# EAGLE schematic SaintCon2015Badge (EAGLE 7.3.0)

## Sheet 1 of 3
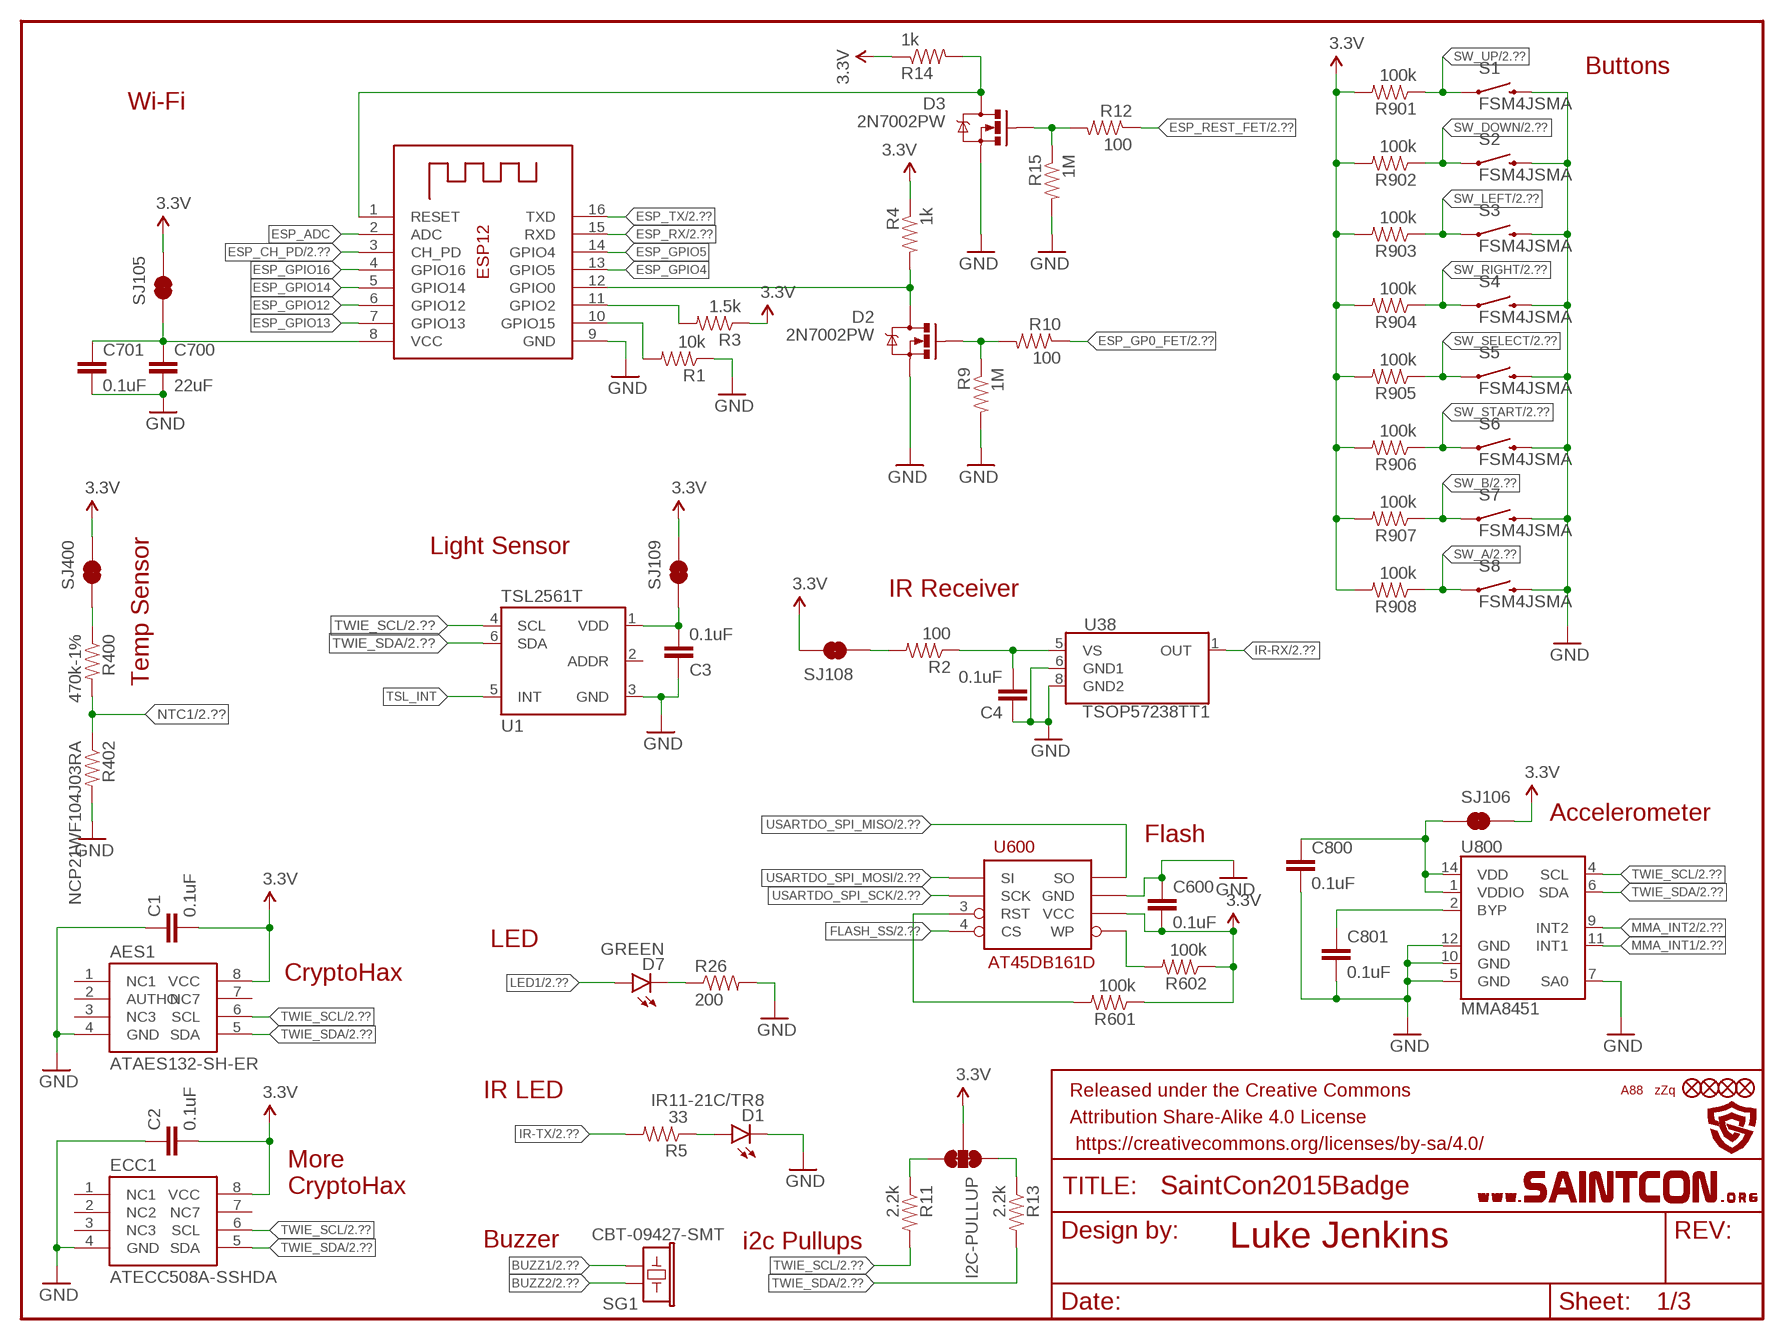
[diagram p0: schematic, sheet 1]

### Parts
AES1  ATAES132-SH-ER  ATAES132  [SOIC8]
C1  0.1uF  CAP0805  [0805]
C2  0.1uF  CAP0805  [0805]
C3  0.1uF  CAP0805  [0805]
C4  0.1uF  CAP0805  [0805]
C600  0.1uF  CAP0805  [0805]
C700  22uF  22UF-6.3V-20%(0805)  [0805]
C701  0.1uF  CAP0805  [0805]
C800  0.1uF  CAP0805  [0805]
C801  0.1uF  CAP0805  [0805]
D1  IR11-21C/TR8  LED1206  [LED-1206]
D2  2N7002PW  MOSFET-NCHANNEL2N7002PW  [SOT323]
D3  2N7002PW  MOSFET-NCHANNEL2N7002PW  [SOT323]
D7  GREEN  LED-RED1206  [LED-1206]
ECC1  ATECC508A-SSHDA  ATECC108  [SOIC8]
ESP12  ESP12  ESP-12  [ESP-12]
FID1  FIDUCIAL1X2  [FIDUCIAL-1X2]
FID2  FIDUCIAL1X2  [FIDUCIAL-1X2]
FID3  FIDUCIAL1X2  [FIDUCIAL-1X2]
FID4  FIDUCIAL1X2  [FIDUCIAL-1X2]
FRAME3  FRAME-LETTERNO_PACKAGE  [DUMMY]
I2C-PULLUP  JUMPER-PAD-3-NC_BY_TRACE  [PAD-JUMPER-3-3OF3_NC_BY_TRACE_YES_SILK_FULL_BOX]
R1  10k  RESISTOR0805-RES  [0805]
R2  100  RESISTOR0805-RES  [0805]
R3  1.5k  RESISTOR0805-RES  [0805]
R4  1k  RESISTOR0805-RES  [0805]
R5  33  RESISTOR0805-RES  [0805]
R9  1M  RESISTOR0805-RES  [0805]
R10  100  RESISTOR0805-RES  [0805]
R11  2.2k  RESISTOR0805-RES  [0805]
R12  100  RESISTOR0805-RES  [0805]
R13  2.2k  RESISTOR0805-RES  [0805]
R14  1k  RESISTOR0805-RES  [0805]
R15  1M  RESISTOR0805-RES  [0805]
R26  200  RESISTOR0805-RES  [0805]
R400  470k-1%  RESISTOR0805-RES  [0805]
R402  NCP21WF104J03RA  RESISTOR0805-RES  [0805]
R601  100k  RESISTOR0805-RES  [0805]
R602  100k  RESISTOR0805-RES  [0805]
R901  100k  RESISTOR0805-RES  [0805]
R902  100k  RESISTOR0805-RES  [0805]
R903  100k  RESISTOR0805-RES  [0805]
R904  100k  RESISTOR0805-RES  [0805]
R905  100k  RESISTOR0805-RES  [0805]
R906  100k  RESISTOR0805-RES  [0805]
R907  100k  RESISTOR0805-RES  [0805]
R908  100k  RESISTOR0805-RES  [0805]
S1  FSM4JSMA  SWITCH-MOMENTARY-ZZQSMD-4  [TACTILE_SWITCH_ZZQ]
S2  FSM4JSMA  SWITCH-MOMENTARY-ZZQSMD-4  [TACTILE_SWITCH_ZZQ]
S3  FSM4JSMA  SWITCH-MOMENTARY-ZZQSMD-4  [TACTILE_SWITCH_ZZQ]
S4  FSM4JSMA  SWITCH-MOMENTARY-ZZQSMD-4  [TACTILE_SWITCH_ZZQ]
S5  FSM4JSMA  SWITCH-MOMENTARY-ZZQSMD-4  [TACTILE_SWITCH_ZZQ]
S6  FSM4JSMA  SWITCH-MOMENTARY-ZZQSMD-4  [TACTILE_SWITCH_ZZQ]
S7  FSM4JSMA  SWITCH-MOMENTARY-ZZQSMD-4  [TACTILE_SWITCH_ZZQ]
S8  FSM4JSMA  SWITCH-MOMENTARY-ZZQSMD-4  [TACTILE_SWITCH_ZZQ]
SG1  CBT-09427-SMT  BUZZERSMD2-KIT  [BUZZER-CCV-KIT]
SJ105  JUMPER-PAD-2-NC_BY_TRACE  [PAD-JUMPER-2-NC_BY_TRACE_YES_SILK]
SJ106  JUMPER-PAD-2-NC_BY_TRACE  [PAD-JUMPER-2-NC_BY_TRACE_YES_SILK]
SJ108  JUMPER-PAD-2-NC_BY_TRACE  [PAD-JUMPER-2-NC_BY_TRACE_YES_SILK]
SJ109  JUMPER-PAD-2-NC_BY_TRACE  [PAD-JUMPER-2-NC_BY_TRACE_YES_SILK]
SJ400  JUMPER-PAD-2-NC_BY_TRACE  [PAD-JUMPER-2-NC_BY_TRACE_YES_SILK]
U1  TSL2561T  [TMB-6]
U38  TSOP57238TT1  [TSOP572]
U600  AT45DB161D  [SO08-EIAJ]
U800  MMA8451  MMA8452Q  [QFN-16_0.5MM]
U$1  AZZQ  [AZZQ]
U$2  A88  [A88]
U$4  SAINTCON-LOGO  [SAINTCON-LOGO]
U$5  SAINTCON-HEADER  [SAINTCON-HEADER]

### Nets
3.3V: AES1.8(VCC) C1.2 C2.2 C600.2 ECC1.8(VCC) I2C-PULLUP.2 R3.1 R4.1 R14.1 R601.1 R602.1 R901.2 R902.2 R903.2 R904.2 R905.2 R906.2 R907.2 R908.2 SJ105.2 SJ106.2 SJ108.2 SJ109.2 SJ400.2 U600.6(VCC) ; also sheet 2,3
AT45-/RST: R601.2 U600.3(RST)
AT45-/WP: R602.2 U600.5(WP)
BUZZ1: SG1.+ ; also sheet 2
BUZZ2: SG1.- ; also sheet 2
D7-R26: D7.C R26.1
ESP_ADC: ESP12.2(ADC)
ESP_CH_PD: ESP12.3(CH_PD) ; also sheet 2
ESP_GP0_FET: R10.1 ; also sheet 2
ESP_GPIO0: D2.3(D) ESP12.12(GPIO0) R4.2
ESP_GPIO0_FET_GATE: D2.1(G) R9.1 R10.2
ESP_GPIO2: ESP12.11(GPIO2) R3.2
ESP_GPIO4: ESP12.13(GPIO5)
ESP_GPIO5: ESP12.14(GPIO4)
ESP_GPIO12: ESP12.6(GPIO12)
ESP_GPIO13: ESP12.7(GPIO13)
ESP_GPIO14: ESP12.5(GPIO14)
ESP_GPIO15: ESP12.10(GPIO15) R1.2
ESP_GPIO16: ESP12.4(GPIO16)
ESP_REST: D3.3(D) ESP12.1(RESET) R14.2
ESP_REST_FET: R12.1 ; also sheet 2
ESP_REST_FET_GATE: D3.1(G) R12.2 R15.1
ESP_RX: ESP12.15(RXD) ; also sheet 2
ESP_TX: ESP12.16(TXD) ; also sheet 2
ESP_VCC: C700.1 C701.1 ESP12.8(VCC) SJ105.1
FLASH_SS: U600.4(CS) ; also sheet 2
GND: AES1.4(GND) C1.1 C2.1 C3.1 C4.1 C600.1 C700.2 C701.2 C800.2 C801.2 D1.C D2.2(S) D3.2(S) ECC1.4(GND) ESP12.9(GND) R1.1 R9.2 R15.2 R26.2 R402.2 S1.B2 S2.B2 S3.B2 S4.B2 S5.B2 S6.B2 S7.B2 S8.B2 U1.3(GND) U38.6(GND1) U38.8(GND2) U600.7(GND) U800.5(GND) U800.7(SA0) U800.10(GND) U800.12(GND) ; also sheet 2,3
IR-RX: U38.1(OUT) ; also sheet 2
IR-RX-VS: C4.2 R2.1 U38.5(VS)
IR-TX: R5.2 ; also sheet 2
IR-TX-R: D1.A R5.1
LED1: D7.A ; also sheet 2
MMA8451-BYP: C801.1 U800.2(BYP)
MMA_INT1: U800.11(INT1) ; also sheet 2
MMA_INT2: U800.9(INT2) ; also sheet 2
MMA_VCC: C800.1 SJ106.1 U800.1(VDDIO) U800.14(VDD)
NTC1: R400.2 R402.1 ; also sheet 2
R2-IN: R2.2 SJ108.1
R11-IN: I2C-PULLUP.3 R11.1
R13-IN: I2C-PULLUP.1 R13.1
R400-SJ400: R400.1 SJ400.1
SW_A: R908.1 S8.A2 ; also sheet 2
SW_B: R907.1 S7.A2 ; also sheet 2
SW_DOWN: R902.1 S2.A2 ; also sheet 2
SW_LEFT: R903.1 S3.A2 ; also sheet 2
SW_RIGHT: R904.1 S4.A2 ; also sheet 2
SW_SELECT: R905.1 S5.A2 ; also sheet 2
SW_START: R906.1 S6.A2 ; also sheet 2
SW_UP: R901.1 S1.A2 ; also sheet 2
TSL2561-VDD: C3.2 SJ109.1 U1.1(VDD)
TSL_INT: U1.5(INT)
TWIE_SCL: AES1.6(SCL) ECC1.6(SCL) R11.2 U1.4(SCL) U800.4(SCL) ; also sheet 2,3
TWIE_SDA: AES1.5(SDA) ECC1.5(SDA) R13.2 U1.6(SDA) U800.6(SDA) ; also sheet 2,3
USARTDO_SPI_MISO: U600.8(SO) ; also sheet 2
USARTDO_SPI_MOSI: U600.1(SI) ; also sheet 2
USARTDO_SPI_SCK: U600.2(SCK) ; also sheet 2
Unconnected: AES1.1(NC1) AES1.2(AUTHO) AES1.3(NC3) AES1.7(NC7) ECC1.1(NC1) ECC1.2(NC2) ECC1.3(NC3) ECC1.7(NC7) U1.2(ADDR)

### Notes on the sheet
- Buttons
- Wi-Fi
- Light Sensor
- IR Receiver
- Temp Sensor
- Accelerometer
- Flash
- LED
- CryptoHax
- IR LED
- More
  CryptoHax
- Buzzer | i2c Pullups | Luke Jenkins

## Sheet 2 of 3
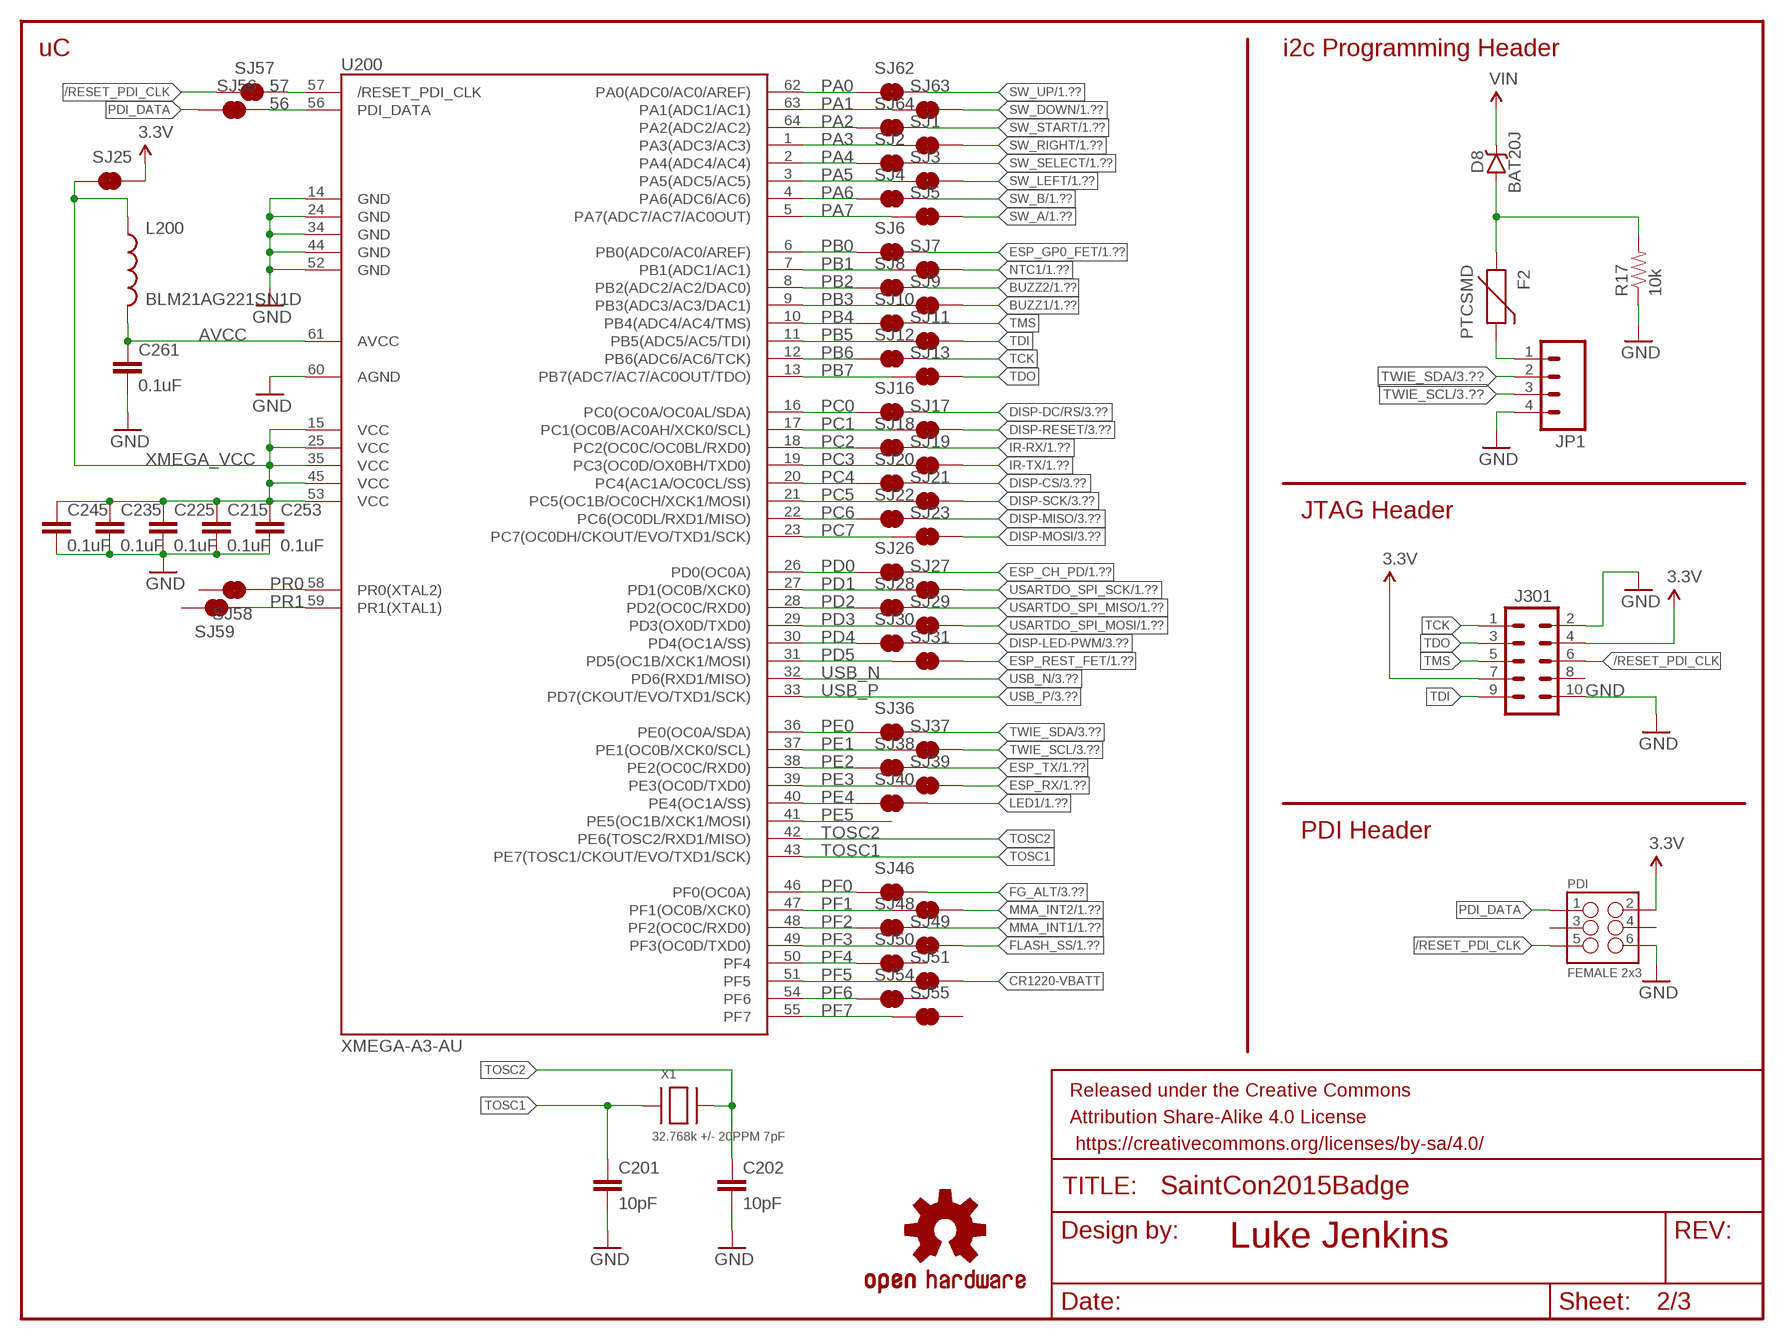
[diagram p1: schematic, sheet 2]

### Parts
C201  10pF  CAP0805  [0805]
C202  10pF  CAP0805  [0805]
C215  0.1uF  CAP0805  [0805]
C225  0.1uF  CAP0805  [0805]
C235  0.1uF  CAP0805  [0805]
C245  0.1uF  CAP0805  [0805]
C253  0.1uF  CAP0805  [0805]
C261  0.1uF  CAP0805  [0805]
D8  BAT20J  DIODE-SCHOTTKY-BAT20J  [SOD-323]
F2  PTCSMD  [PTC-1206]
FRAME1  FRAME-LETTERNO_PACKAGE  [DUMMY]
J301  M05X2PTH  [AVR_ICSP]
JP1  M04PTH  [1X04]
L200  BLM21AG221SN1D  INDUCTOR0805  [0805]
LOGO1  OSHW-LOGOS-COPPER  [OSHW-LOGO-S_COPPER]
LOGO2  OSHW-LOGOS  [OSHW-LOGO-S]
PDI  FEMALE 2x3  M03X2FEMALE  [2X3]
R17  10k  RESISTOR0805-RES  [0805]
SJ1  JUMPER-PAD-2-NC_BY_TRACE  [PAD-JUMPER-2-NC_BY_TRACE_YES_SILK]
SJ2  JUMPER-PAD-2-NC_BY_TRACE  [PAD-JUMPER-2-NC_BY_TRACE_YES_SILK]
SJ3  JUMPER-PAD-2-NC_BY_TRACE  [PAD-JUMPER-2-NC_BY_TRACE_YES_SILK]
SJ4  JUMPER-PAD-2-NC_BY_TRACE  [PAD-JUMPER-2-NC_BY_TRACE_YES_SILK]
SJ5  JUMPER-PAD-2-NC_BY_TRACE  [PAD-JUMPER-2-NC_BY_TRACE_YES_SILK]
SJ6  JUMPER-PAD-2-NC_BY_TRACE  [PAD-JUMPER-2-NC_BY_TRACE_YES_SILK]
SJ7  JUMPER-PAD-2-NC_BY_TRACE  [PAD-JUMPER-2-NC_BY_TRACE_YES_SILK]
SJ8  JUMPER-PAD-2-NC_BY_TRACE  [PAD-JUMPER-2-NC_BY_TRACE_YES_SILK]
SJ9  JUMPER-PAD-2-NC_BY_TRACE  [PAD-JUMPER-2-NC_BY_TRACE_YES_SILK]
SJ10  JUMPER-PAD-2-NC_BY_TRACE  [PAD-JUMPER-2-NC_BY_TRACE_YES_SILK]
SJ11  JUMPER-PAD-2-NC_BY_TRACE  [PAD-JUMPER-2-NC_BY_TRACE_YES_SILK]
SJ12  JUMPER-PAD-2-NC_BY_TRACE  [PAD-JUMPER-2-NC_BY_TRACE_YES_SILK]
SJ13  JUMPER-PAD-2-NC_BY_TRACE  [PAD-JUMPER-2-NC_BY_TRACE_YES_SILK]
SJ16  JUMPER-PAD-2-NC_BY_TRACE  [PAD-JUMPER-2-NC_BY_TRACE_YES_SILK]
SJ17  JUMPER-PAD-2-NC_BY_TRACE  [PAD-JUMPER-2-NC_BY_TRACE_YES_SILK]
SJ18  JUMPER-PAD-2-NC_BY_TRACE  [PAD-JUMPER-2-NC_BY_TRACE_YES_SILK]
SJ19  JUMPER-PAD-2-NC_BY_TRACE  [PAD-JUMPER-2-NC_BY_TRACE_YES_SILK]
SJ20  JUMPER-PAD-2-NC_BY_TRACE  [PAD-JUMPER-2-NC_BY_TRACE_YES_SILK]
SJ21  JUMPER-PAD-2-NC_BY_TRACE  [PAD-JUMPER-2-NC_BY_TRACE_YES_SILK]
SJ22  JUMPER-PAD-2-NC_BY_TRACE  [PAD-JUMPER-2-NC_BY_TRACE_YES_SILK]
SJ23  JUMPER-PAD-2-NC_BY_TRACE  [PAD-JUMPER-2-NC_BY_TRACE_YES_SILK]
SJ25  JUMPER-PAD-2-NC_BY_TRACE  [PAD-JUMPER-2-NC_BY_TRACE_YES_SILK]
SJ26  JUMPER-PAD-2-NC_BY_TRACE  [PAD-JUMPER-2-NC_BY_TRACE_YES_SILK]
SJ27  JUMPER-PAD-2-NC_BY_TRACE  [PAD-JUMPER-2-NC_BY_TRACE_YES_SILK]
SJ28  JUMPER-PAD-2-NC_BY_TRACE  [PAD-JUMPER-2-NC_BY_TRACE_YES_SILK]
SJ29  JUMPER-PAD-2-NC_BY_TRACE  [PAD-JUMPER-2-NC_BY_TRACE_YES_SILK]
SJ30  JUMPER-PAD-2-NC_BY_TRACE  [PAD-JUMPER-2-NC_BY_TRACE_YES_SILK]
SJ31  JUMPER-PAD-2-NC_BY_TRACE  [PAD-JUMPER-2-NC_BY_TRACE_YES_SILK]
SJ36  JUMPER-PAD-2-NC_BY_TRACE  [PAD-JUMPER-2-NC_BY_TRACE_YES_SILK]
SJ37  JUMPER-PAD-2-NC_BY_TRACE  [PAD-JUMPER-2-NC_BY_TRACE_YES_SILK]
SJ38  JUMPER-PAD-2-NC_BY_TRACE  [PAD-JUMPER-2-NC_BY_TRACE_YES_SILK]
SJ39  JUMPER-PAD-2-NC_BY_TRACE  [PAD-JUMPER-2-NC_BY_TRACE_YES_SILK]
SJ40  JUMPER-PAD-2-NC_BY_TRACE  [PAD-JUMPER-2-NC_BY_TRACE_YES_SILK]
SJ46  JUMPER-PAD-2-NC_BY_TRACE  [PAD-JUMPER-2-NC_BY_TRACE_YES_SILK]
SJ47  JUMPER-PAD-2-NC_BY_TRACE  [PAD-JUMPER-2-NC_BY_TRACE_YES_SILK]
SJ48  JUMPER-PAD-2-NC_BY_TRACE  [PAD-JUMPER-2-NC_BY_TRACE_YES_SILK]
SJ49  JUMPER-PAD-2-NC_BY_TRACE  [PAD-JUMPER-2-NC_BY_TRACE_YES_SILK]
SJ50  JUMPER-PAD-2-NC_BY_TRACE  [PAD-JUMPER-2-NC_BY_TRACE_YES_SILK]
SJ51  JUMPER-PAD-2-NC_BY_TRACE  [PAD-JUMPER-2-NC_BY_TRACE_YES_SILK]
SJ54  JUMPER-PAD-2-NC_BY_TRACE  [PAD-JUMPER-2-NC_BY_TRACE_YES_SILK]
SJ55  JUMPER-PAD-2-NC_BY_TRACE  [PAD-JUMPER-2-NC_BY_TRACE_YES_SILK]
SJ56  JUMPER-PAD-2-NC_BY_TRACE  [PAD-JUMPER-2-NC_BY_TRACE_YES_SILK]
SJ57  JUMPER-PAD-2-NC_BY_TRACE  [PAD-JUMPER-2-NC_BY_TRACE_YES_SILK]
SJ58  JUMPER-PAD-2-NC_BY_TRACE  [PAD-JUMPER-2-NC_BY_TRACE_YES_SILK]
SJ59  JUMPER-PAD-2-NC_BY_TRACE  [PAD-JUMPER-2-NC_BY_TRACE_YES_SILK]
SJ62  JUMPER-PAD-2-NC_BY_TRACE  [PAD-JUMPER-2-NC_BY_TRACE_YES_SILK]
SJ63  JUMPER-PAD-2-NC_BY_TRACE  [PAD-JUMPER-2-NC_BY_TRACE_YES_SILK]
SJ64  JUMPER-PAD-2-NC_BY_TRACE  [PAD-JUMPER-2-NC_BY_TRACE_YES_SILK]
U200  XMEGA-A3-AU  [TQFP64_14X14MM]
X1  32.768k +/- 20PPM 7pF  XTAL-3.2X1.5  [XTAL3215]

### Nets
3.3V: J301.4 J301.7 PDI.2 SJ25.2 ; also sheet 1,3
56: SJ56.2 U200.56(PDI_DATA)
57: SJ57.2 U200.57(/RESET_PDI_CLK)
/RESET_PDI_CLK: J301.6 PDI.5 SJ57.1
AVCC: C261.1 L200.2 U200.61(AVCC)
BUZZ1: SJ9.2 ; also sheet 1
BUZZ2: SJ8.2 ; also sheet 1
CR1220-VBATT: SJ51.2 ; also sheet 3
DISP-CS: SJ20.2 ; also sheet 3
DISP-DC/RS: SJ16.2 ; also sheet 3
DISP-LED-PWM: SJ30.2 ; also sheet 3
DISP-MISO: SJ22.2 ; also sheet 3
DISP-MOSI: SJ23.2 ; also sheet 3
DISP-RESET: SJ17.2 ; also sheet 3
DISP-SCK: SJ21.2 ; also sheet 3
ESP_CH_PD: SJ26.2 ; also sheet 1
ESP_GP0_FET: SJ6.2 ; also sheet 1
ESP_REST_FET: SJ31.2 ; also sheet 1
ESP_RX: SJ39.2 ; also sheet 1
ESP_TX: SJ38.2 ; also sheet 1
F2-D8-R17: D8.A F2.1 R17.2
FG_ALT: SJ46.2 ; also sheet 3
FLASH_SS: SJ49.2 ; also sheet 1
GND: C201.2 C202.2 C215.2 C225.2 C235.2 C245.2 C253.2 C261.2 J301.2 J301.10 JP1.4 PDI.6 R17.1 U200.14(GND1) U200.24(GND2) U200.34(GND3) U200.44(GND4) U200.52(GND5) U200.60(AGND) ; also sheet 1,3
IR-RX: SJ18.2 ; also sheet 1
IR-TX: SJ19.2 ; also sheet 1
J1-F2: F2.2 JP1.1
LED1: SJ40.2 ; also sheet 1
MMA_INT1: SJ48.2 ; also sheet 1
MMA_INT2: SJ47.2 ; also sheet 1
NTC1: SJ7.2 ; also sheet 1
PA0: SJ62.1 U200.62(PA0(ADC0/AC0/AREF))
PA1: SJ63.1 U200.63(PA1(ADC1/AC1))
PA2: SJ64.1 U200.64(PA2(ADC2/AC2))
PA3: SJ1.1 U200.1(PA3(ADC3/AC3))
PA4: SJ2.1 U200.2(PA4(ADC4/AC4))
PA5: SJ3.1 U200.3(PA5(ADC5/AC5))
PA6: SJ4.1 U200.4(PA6(ADC6/AC6))
PA7: SJ5.1 U200.5(PA7(ADC7/AC7/AC0OUT))
PB0: SJ6.1 U200.6(PB0(ADC0/AC0/AREF))
PB1: SJ7.1 U200.7(PB1(ADC1/AC1))
PB2: SJ8.1 U200.8(PB2(ADC2/AC2/DAC0))
PB3: SJ9.1 U200.9(PB3(ADC3/AC3/DAC1))
PB4: SJ10.1 U200.10(PB4(ADC4/AC4/TMS))
PB5: SJ11.1 U200.11(PB5(ADC5/AC5/TDI))
PB6: SJ12.1 U200.12(PB6(ADC6/AC6/TCK))
PB7: SJ13.1 U200.13(PB7(ADC7/AC7/AC0OUT/TDO))
PC0: SJ16.1 U200.16(PC0(OC0A/OC0AL/SDA))
PC1: SJ17.1 U200.17(PC1(OC0B/AC0AH/XCK0/SCL))
PC2: SJ18.1 U200.18(PC2(OC0C/OC0BL/RXD0))
PC3: SJ19.1 U200.19(PC3(OC0D/OX0BH/TXD0))
PC4: SJ20.1 U200.20(PC4(AC1A/OC0CL/SS))
PC5: SJ21.1 U200.21(PC5(OC1B/OC0CH/XCK1/MOSI))
PC6: SJ22.1 U200.22(PC6(OC0DL/RXD1/MISO))
PC7: SJ23.1 U200.23(PC7(OC0DH/CKOUT/EVO/TXD1/SCK))
PD0: SJ26.1 U200.26(PD0(OC0A))
PD1: SJ27.1 U200.27(PD1(OC0B/XCK0))
PD2: SJ28.1 U200.28(PD2(OC0C/RXD0))
PD3: SJ29.1 U200.29(PD3(OX0D/TXD0))
PD4: SJ30.1 U200.30(PD4(OC1A/SS))
PD5: SJ31.1 U200.31(PD5(OC1B/XCK1/MOSI))
PDI_DATA: PDI.1 SJ56.1
PE0: SJ36.1 U200.36(PE0(OC0A/SDA))
PE1: SJ37.1 U200.37(PE1(OC0B/XCK0/SCL))
PE2: SJ38.1 U200.38(PE2(OC0C/RXD0))
PE3: SJ39.1 U200.39(PE3(OC0D/TXD0))
PE4: SJ40.1 U200.40(PE4(OC1A/SS))
PE5: U200.41(PE5(OC1B/XCK1/MOSI))
PF0: SJ46.1 U200.46(PF0(OC0A))
PF1: SJ47.1 U200.47(PF1(OC0B/XCK0))
PF2: SJ48.1 U200.48(PF2(OC0C/RXD0))
PF3: SJ49.1 U200.49(PF3(OC0D/TXD0))
PF4: SJ50.1 U200.50(PF4)
PF5: SJ51.1 U200.51(PF5)
PF6: SJ54.1 U200.54(PF6)
PF7: SJ55.1 U200.55(PF7)
PR0: SJ58.1 U200.58(PR0(XTAL2))
PR1: SJ59.1 U200.59(PR1(XTAL1))
SW_A: SJ5.2 ; also sheet 1
SW_B: SJ4.2 ; also sheet 1
SW_DOWN: SJ63.2 ; also sheet 1
SW_LEFT: SJ3.2 ; also sheet 1
SW_RIGHT: SJ1.2 ; also sheet 1
SW_SELECT: SJ2.2 ; also sheet 1
SW_START: SJ64.2 ; also sheet 1
SW_UP: SJ62.2 ; also sheet 1
TCK: J301.1 SJ12.2
TDI: J301.9 SJ11.2
TDO: J301.3 SJ13.2
TMS: J301.5 SJ10.2
TOSC1: C201.1 U200.43(PE7(TOSC1/CKOUT/EVO/TXD1/SCK)) X1.P$1
TOSC2: C202.1 U200.42(PE6(TOSC2/RXD1/MISO)) X1.P$2
TWIE_SCL: JP1.3 SJ37.2 ; also sheet 1,3
TWIE_SDA: JP1.2 SJ36.2 ; also sheet 1,3
USARTDO_SPI_MISO: SJ28.2 ; also sheet 1
USARTDO_SPI_MOSI: SJ29.2 ; also sheet 1
USARTDO_SPI_SCK: SJ27.2 ; also sheet 1
USB_N: U200.32(PD6(RXD1/MISO)) ; also sheet 3
USB_P: U200.33(PD7(CKOUT/EVO/TXD1/SCK)) ; also sheet 3
VIN: D8.C ; also sheet 3
XMEGA_VCC: C215.1 C225.1 C235.1 C245.1 C253.1 L200.1 SJ25.1 U200.15(VCC1) U200.25(VCC2) U200.35(VCC3) U200.45(VCC4) U200.53(VCC5)
Unconnected: J301.8 PDI.3 PDI.4 SJ50.2 SJ54.2 SJ55.2 SJ58.2 SJ59.2

### Notes on the sheet
- uC | i2c Programming Header
- JTAG Header
- PDI Header
- Luke Jenkins

## Sheet 3 of 3
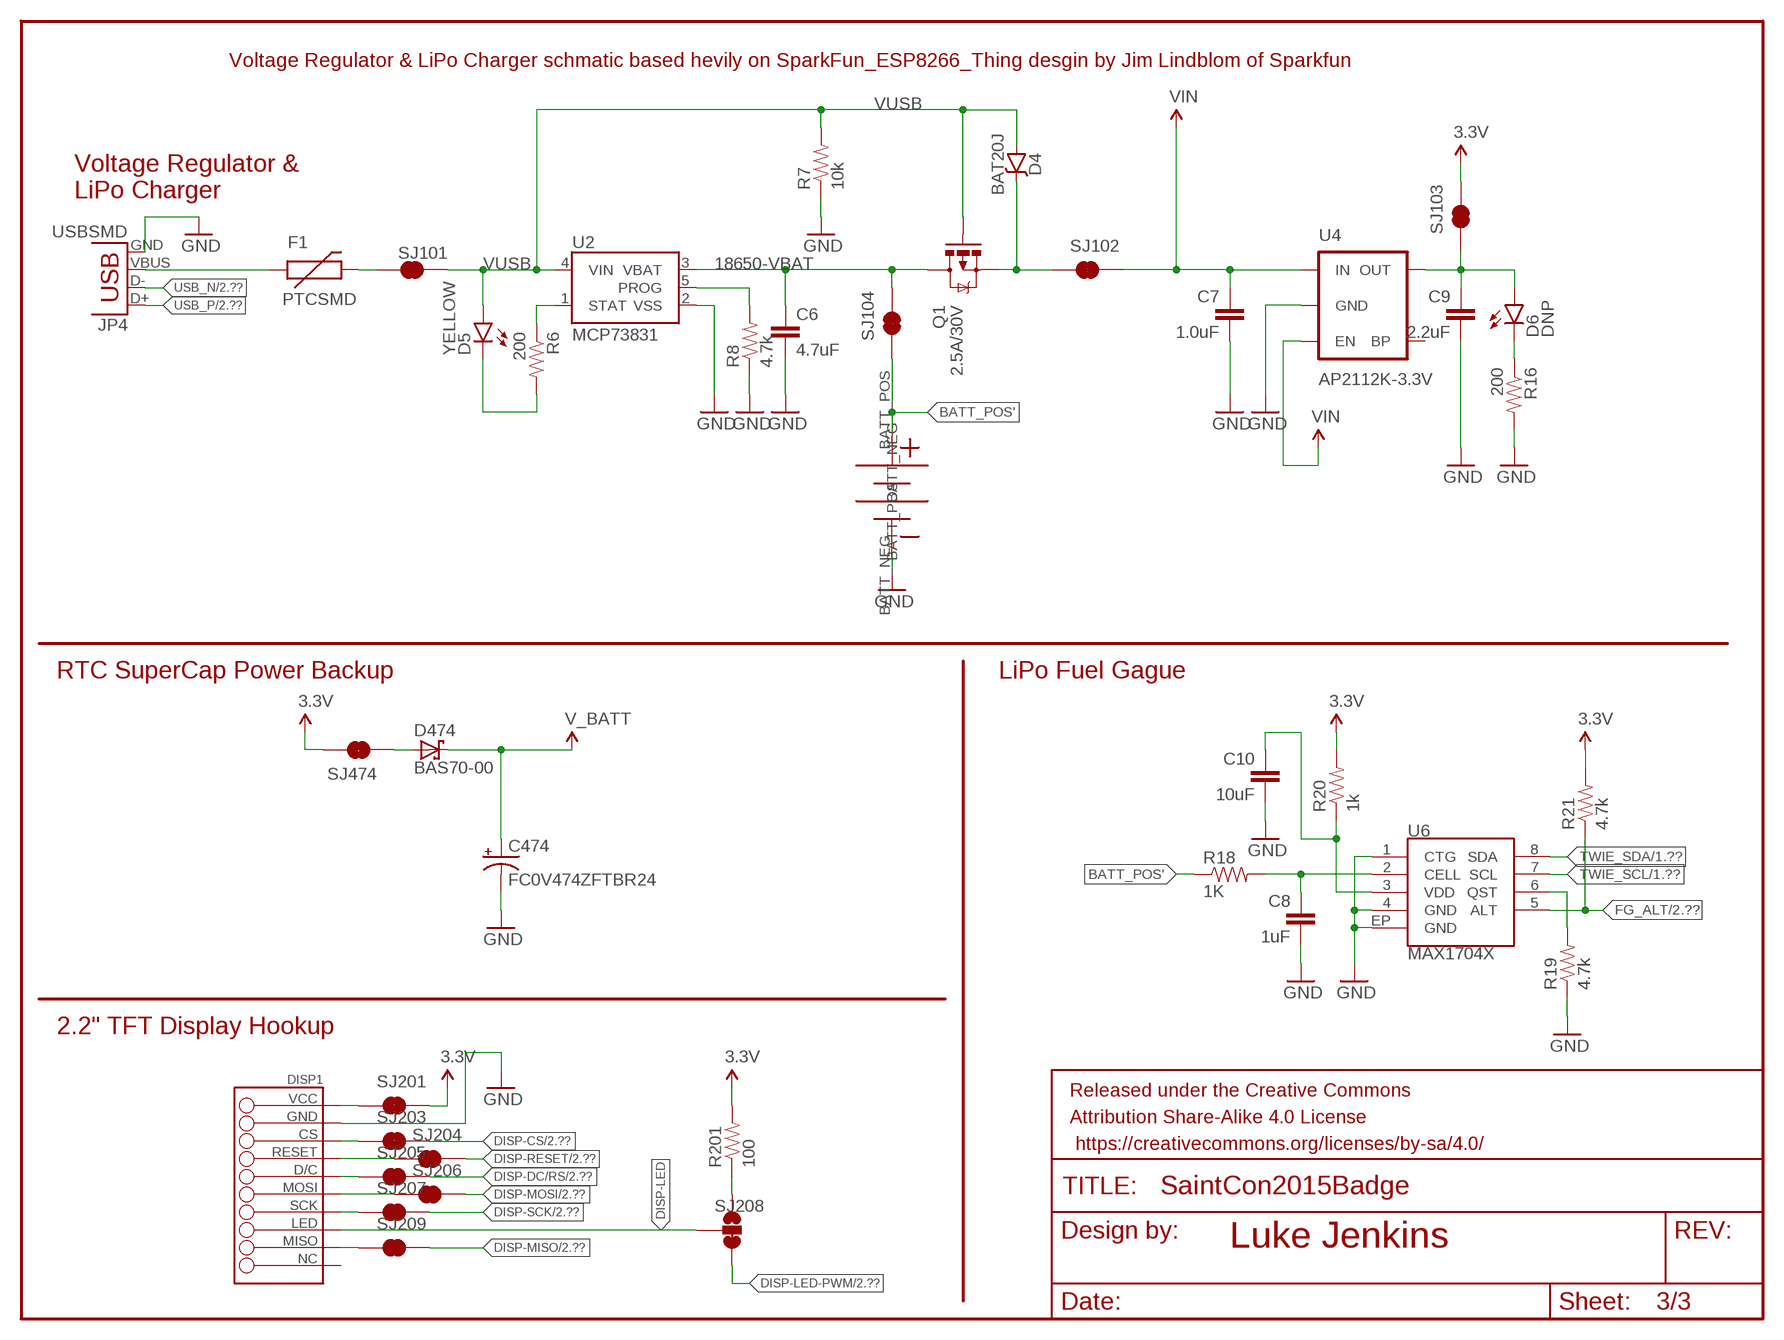
[diagram p2: schematic, sheet 3]

### Parts
BATT2  1042P  [1042P]
C6  4.7uF  CAP0805  [0805]
C7  1.0uF  CAP0805  [0805]
C8  1uF  CAP0805  [0805]
C9  2.2uF  CAP0805  [0805]
C10  10uF  CAP0805  [0805]
C474  FC0V474ZFTBR24  CPOL-US153CLV-1014  [153CLV-1014]
D4  BAT20J  DIODE-SCHOTTKY-BAT20J  [SOD-323]
D5  YELLOW  LED-YELLOWLARGE  [LED-1206]
D6  DNP  LED-RED1206  [LED-1206]
D474  BAS70-00  BAS70  [SOT23]
DISP1  TFT22FEMALE_SMD  [TFT22]
F1  PTCSMD  [PTC-1206]
FRAME2  FRAME-LETTERNO_PACKAGE  [DUMMY]
JP4  USBSMD  [USB-MINIB]
Q1  2.5A/30V  MOSFET-PCHANNELDMG2307L  [SOT23-3]
R6  200  RESISTOR0805-RES  [0805]
R7  10k  RESISTOR0805-RES  [0805]
R8  4.7k  RESISTOR0805-RES  [0805]
R16  200  RESISTOR0805-RES  [0805]
R18  1K  RESISTOR0805-RES  [0805]
R19  4.7k  RESISTOR0805-RES  [0805]
R20  1k  RESISTOR0805-RES  [0805]
R21  4.7k  RESISTOR0805-RES  [0805]
R201  100  RESISTOR0805-RES  [0805]
SJ101  JUMPER-PAD-2-NC_BY_TRACE  [PAD-JUMPER-2-NC_BY_TRACE_YES_SILK]
SJ102  JUMPER-PAD-2-NC_BY_TRACE  [PAD-JUMPER-2-NC_BY_TRACE_YES_SILK]
SJ103  JUMPER-PAD-2-NC_BY_TRACE  [PAD-JUMPER-2-NC_BY_TRACE_YES_SILK]
SJ104  JUMPER-PAD-2-NC_BY_TRACE  [PAD-JUMPER-2-NC_BY_TRACE_YES_SILK]
SJ201  JUMPER-PAD-2-NC_BY_TRACE  [PAD-JUMPER-2-NC_BY_TRACE_YES_SILK]
SJ203  JUMPER-PAD-2-NC_BY_TRACE  [PAD-JUMPER-2-NC_BY_TRACE_YES_SILK]
SJ204  JUMPER-PAD-2-NC_BY_TRACE  [PAD-JUMPER-2-NC_BY_TRACE_YES_SILK]
SJ205  JUMPER-PAD-2-NC_BY_TRACE  [PAD-JUMPER-2-NC_BY_TRACE_YES_SILK]
SJ206  JUMPER-PAD-2-NC_BY_TRACE  [PAD-JUMPER-2-NC_BY_TRACE_YES_SILK]
SJ207  JUMPER-PAD-2-NC_BY_TRACE  [PAD-JUMPER-2-NC_BY_TRACE_YES_SILK]
SJ208  JUMPER-PAD-3-2OF3_NC_BY_TRACE_SMALL  [PAD-JUMPER-3-2OF3_NC_BY_TRACE_YES_SILK_FULL_BOX]
SJ209  JUMPER-PAD-2-NC_BY_TRACE  [PAD-JUMPER-2-NC_BY_TRACE_YES_SILK]
SJ474  JUMPER-PAD-2-NC_BY_TRACE  [PAD-JUMPER-2-NC_BY_TRACE_YES_SILK]
U2  MCP73831  [SOT23-5]
U4  AP2112K-3.3V  V_REG_LDOSMD  [SOT23-5]
U6  MAX1704X  [TDFN-8]

### Nets
3.3V: R20.2 R21.2 R201.2 SJ103.2 SJ201.2 SJ474.2 ; also sheet 1,2
18650-VBAT: C6.1 Q1.3(D) SJ104.2 U2.3(VBAT)
BATT_POS': BATT2.BATT_POS R18.1 SJ104.1
CR1220-VBATT: C474.+ D474.3(C) ; supply symbol labelled V_BATT ; also sheet 2
D4-OUT: D4.C Q1.2(S) SJ102.1
D5-R6: D5.C R6.2
D6-R16: D6.C R16.1
DISP1-CS: DISP1.CS SJ203.1
DISP1-D/C: DISP1.D/C SJ205.1
DISP1-MISO: DISP1.MISO SJ209.1
DISP1-MOSI: DISP1.MOSI SJ206.1
DISP1-RESET: DISP1.RESET SJ204.1
DISP1-SCK: DISP1.SCK SJ207.1
DISP1-VCC: DISP1.VCC SJ201.1
DISP-CS: SJ203.2 ; also sheet 2
DISP-DC/RS: SJ205.2 ; also sheet 2
DISP-LED: DISP1.LED SJ208.2
DISP-LED-100: R201.1 SJ208.1
DISP-LED-PWM: SJ208.3 ; also sheet 2
DISP-MISO: SJ209.2 ; also sheet 2
DISP-MOSI: SJ206.2 ; also sheet 2
DISP-RESET: SJ204.2 ; also sheet 2
DISP-SCK: SJ207.2 ; also sheet 2
F1-SJ: F1.2 SJ101.1
FG_ALT: R21.1 U6.5(ALT) ; also sheet 2
FG_CELL: C8.1 R18.2 U6.2(CELL)
FG_QST: R19.2 U6.6(QST)
FG_VDD: C10.1 R20.1 U6.3(VDD)
GND: BATT2.BATT_NEG C6.2 C7.2 C8.2 C9.2 C10.2 C474.- DISP1.GND JP4.GND R7.1 R8.1 R16.2 R19.1 U2.2(VSS) U4.2(GND) U6.1(CTG) U6.4(GND) U6.EP(GND) ; also sheet 1,2
MCP73831-PROG: R8.2 U2.5(PROG)
MCP73831-STAT: R6.1 U2.1(STAT)
REG_OUT: C9.1 D6.A SJ103.1 U4.5(OUT)
SJ474-D474: D474.1(A) SJ474.1
TWIE_SCL: U6.7(SCL) ; also sheet 1,2
TWIE_SDA: U6.8(SDA) ; also sheet 1,2
USB-F1: F1.1 JP4.VBUS
USB_N: JP4.D- ; also sheet 2
USB_P: JP4.D+ ; also sheet 2
VIN: C7.1 SJ102.2 U4.1(IN) U4.3(EN) ; also sheet 2
VUSB: D4.A D5.A Q1.1(G) R7.2 SJ101.2 U2.4(VIN)
Unconnected: DISP1.NC U4.4(BP)

### Notes on the sheet
- Voltage Regulator & LiPo Charger schmatic based hevily on SparkFun_ESP8266_Thing desgin by Jim Lindblom of Sparkfun
- Voltage Regulator &
  LiPo Charger
- RTC SuperCap Power Backup | LiPo Fuel Gague
- 2.2" TFT Display Hookup
- Luke Jenkins

## Library data of the parts
AES1 = SparkFun-DigitalIC:ATAES132: 32Kb Serial EEPROM. AES-128-CCM. MAC. Secure Storage for 128-bit keys. Encrypted User Memory Readn and Write. HWRNG. 2.5V to 5.5V.; PROD_ID: IC-11983
BATT2 = zZq:1042P
C1-C4 C201 C202 C215 C225 C235 C245 C253 C261 C600 C701 C800 C801 = SparkFun-Passives:CAP: Capacitor Standard 0603 ceramic capacitor, and 0.1" leaded capacitor.
C6-C10 = SparkFun-Capacitors:CAP: Capacitor Standard 0603 ceramic capacitor, and 0.1" leaded capacitor.
C474 = rcl:CPOL-US: POLARIZED CAPACITOR, American symbol
C700 = SparkFun-Capacitors:22UF-6.3V-20%(0805): CAP-08402 Ceramic; PROD_ID: CAP-08402
D1 = SparkFun-LED:LED: LEDs Standard schematic elements and footprints for 5mm, 3mm, 1206, and 0603 sized LEDs. 5mm - Spark Fun Electronics SKU : COM-00529 (and others)
D2 D3 = SparkFun-DiscreteSemi:MOSFET-NCHANNEL: Common NMOSFET Parts MFG P/N Store ID Prod ID FDD8780 TRANS-09984 SI7820DN TRANS-11055 FDS6630A IC-08089 2N7002PW TRANS-11151 FQP30N06L COM-10213 TRANS-10060 BSS123LT1G TRANS-08345 BSS138 TRANS-00830 BS170 2N7000; PROD_ID: TRANS-11151
D4 D8 = SparkFun-DiscreteSemi:DIODE-SCHOTTKY: Schottky diodes in SFE's production catalog BAT20J 1A 23V 0.62Vf RB751 120mA 40V 0.37Vf PMEG4005EJ 0.5A 40V 0.42Vf MBRA140 1A 40V 0.5Vf B340A 3A 40V SMA; PROD_ID: DIO-11623
D5 = SparkFun-LED:LED-YELLOW: Yellow SMD LEDs LilyPad 1206- DIO-09909 0603- DIO-09003 "SMART" means more efficient and expensive; PROD_ID: DIO-00820
D6 D7 = SparkFun-LED:LED-RED: Assorted Red LEDs LilyPad 1206- DIO-09912 1206- DIO-00809 0603- DIO-00819 "SMART" means more efficient and expensive; PROD_ID: DIO-00809; VALUE: RED
D474 = diode:BAS70: Silicon Schottky Diodes General-purpose diode for high-speed switching
DISP1 = zZq:TFT22: TFT 2.2" Display; PROD_ID: TFT22
ECC1 = SparkFun-DigitalIC:ATECC108: ATECC108: Provides ECDSA with NIST curves P256, B283, and K283. Also, a RNG, 8.5Kb EEPROM. 2.0V - 5.5V.; PROD_ID: IC-11982
ESP12 = adafruit:ESP-12
F1 F2 = SparkFun-PowerIC:PTC: Resettable Fuse PTC Resettable Fuse. Spark Fun Electronics SKU : COM-08357; PROD_ID: RES-11150
FID1-FID4 = SparkFun-Aesthetics:FIDUCIAL: Fiducial Alignment Points Various fiducial points for machine vision alignment.
FRAME1-FRAME3 = SparkFun-Aesthetics:FRAME-LETTER: Schematic Frame Standard 8.5x11 US Letter frame; DESIGNER: Nobody; VERSION: v01
I2C-PULLUP = SparkFun-Passives:JUMPER-PAD-3-NC_BY_TRACE
J301 = SparkFun-Connectors:M05X2: Header 5x2 Standard 10-pin dual row 0.1" header. Commonly used with AVR-ISP. Use with Spark Fun Electronics SKU: PRT-00778
JP1 = SparkFun-Connectors:M04: Header 4 Standard 4-pin 0.1" header. Use with straight break away headers (SKU : PRT-00116), right angle break away headers (PRT-00553), swiss pins (PRT-00743), machine pins (PRT-00117), and female headers (PRT-00115). Molex polarized connector foot print use with SKU : PRT-08231 with associated crimp pins and housings. 1MM SMD Version SKU: PRT-10208
JP4 = SparkFun-Connectors:USB: USB Connectors USB-B-PTH is fully proven SKU : PRT-00139/CONN-08278 USB-miniB is fully proven SKU : PRT-00587 USB-A-PCB is untested. USB-A-H is throughly reviewed, but untested. Spark Fun Electronics SKU : PRT-00437 USB-B-SMT is throughly reviewed, but untested. Needs silkscreen touching up. USB-A-S has not been used/tested USB-MB-H has not been used/tested USB-MICROB has been used. CONN-09505; PROD_ID: CONN-08193
L200 = SparkFun-Passives:INDUCTOR: Inductors Basic Inductor/Choke - 0603 and 1206. Footprints are not proven and vary greatly between part numbers. INDUCTOR POWER 3.3UH 4.0A SMD 0.197" L x 0.197" W x 0.177" H (5.00mm x 5.00mm x 4.50mm)
LOGO1 LOGO2 = SparkFun-Aesthetics:OSHW-LOGO: Open Source Hardware Logo This logo indicates the piece of hardware it is found on incorporates a OSHW license and/or adheres to the definition of open source hardware found here: http://freedomdefined.org/OSHW
PDI = SparkFun-Connectors:M03X2: 2x3 .1" header. Shrouded, with keying- CONN-10681 SMT- CONN-11415 Pogo pins- HW-11044; PROD_ID: CONN-11566
Q1 = SparkFun-DiscreteSemi:MOSFET-PCHANNEL: Generic PMOSFET IRLML2244 - TRANS-11153 (SOT-23 -20V -4.3A) (1.Gate 2.Source 3.Drain) FQP27P06 - COM-10349 <http://www.sparkfun.com/products/10349> (TO-220 -60V -27A) (1.Gate 2.Source 3.Drain); PROD_ID: TRANS-11308
R1-R5 R9-R15 R400 R402 R601 R602 R901-R908 = SparkFun-Passives:RESISTOR: Resistor Basic schematic elements and footprints for 0603, 1206, and PTH resistors.
R6-R8 R16-R21 R26 R201 = SparkFun-Resistors:RESISTOR: Resistor Basic schematic elements and footprints for 0603, 1206, and PTH resistors.
S1-S8 = zZq:SWITCH-MOMENTARY-ZZQ: Various NO switches- pushbuttons, reed, etc; PROD_ID: FSM4JSMA
SG1 = SparkFun-Electromechanical:BUZZER: Buzzer 12mm Spark Fun Electronics SKU : Comp-Buzzer
SJ1-SJ13 SJ16-SJ23 SJ25-SJ31 SJ36-SJ40 SJ46-SJ51 SJ54-SJ59 SJ62-SJ64 SJ101-SJ106 SJ108 SJ109 SJ201 SJ203-SJ207 SJ209 SJ400 SJ474 = zZq:JUMPER-PAD-2-NC_BY_TRACE
SJ208 = SparkFun-Passives:JUMPER-PAD-3-2OF3_NC_BY_TRACE
U1 = SparkFun-Sensors:TSL2561: TSL2561 illumination sensor Approximates Human Eye Response Precisely Measures Illuminance Programmable Interrupt Function with User-Defined Upper and Lower Threshold 400 KHz I2C interface Programmable Analog Gain and Integration Time Supporting 1,000,000-to-1 Dynamic Range Automatically Rejects 50/60-Hz Lighting Ripple Low Active Power (0.75 mW Typical) with Power Down Mode RoHS Compliant The TSL2561 is a light-to-digital converter that transform light intensity to a digital signal output via I2C interface. The device combines one broadband photodiode (visible plus infrared) and one infrared-responding photodiode on a single CMOS integrated circuit capable of providing a near-photopic response over an effective 20-bit dynamic range (16-bit resolution). Two integrating ADCs convert the photodiode currents to a digital output that represents the irradiance measured on each channel. This digital output can be input to a microprocessor where illuminance (ambient light level) in lux is derived using an empirical formula to approximate the human eye response. The TSL2561 device supports a traditional level style interrupt that remains asserted until the firmware clears it.
U2 = SparkFun-PowerIC:MCP73831: Miniature single cell, fully integrated Li-Ion, Li-polymer charge management controller http://ww1.microchip.com/downloads/en/DeviceDoc/20001984g.pdf IC-09995; PROD_ID: IC-09995
U4 = SparkFun-PowerIC:V_REG_LDO: Voltage Regulator LDO Standard 150mA LDO voltage regulator in SOT-23 layout. Micrel part MIC5205. BP (by-pass) pin is used to lower output noise with 470pF cap.; PROD_ID: VREG-12457
U6 = SparkFun-PowerIC:MAX1704X: MAX17043/MAX17044: Battery Fuel Guage (43 is 1cell, 44 is 2cell); PROD-ID: IC-10399
U38 = SparkFun-Sensors:TSOP57238TT1; PROD_ID: COMP-11990
U200 = SparkFun-DigitalIC:XMEGA-A3: Atmel's 8/16-bit AVR XMEGA A3 Microcontroller - ATxmega256A3, etc.
U600 = SparkFun-DigitalIC:AT45DB161D: 16-Mbit SPI flash memory
U800 = SparkFun-Sensors:MMA8452Q: MMA8452Q 3-Axis, 12/8-bit Digital Accelerometer Supply Voltage: 1.6-3.6V Range: +/- 2g, 4g, 8g Interface: I2C, 12-bit and 8-bit ODR: 1.56 Hz - 800 Hz Package: QFN-16 http://cache.freescale.com/files/sensors/doc/data_sheet/MMA8452Q.pdf; PROD_ID: IC-10769
U$1 = zZq:AZZQ
U$2 = a88:A88
U$4 = SAINTCON:SAINTCON-LOGO
U$5 = SAINTCON:SAINTCON-HEADER
X1 = adafruit:XTAL: Low cost SMT crystals, no capacitors included http://www.ladyada.net/library/eagle